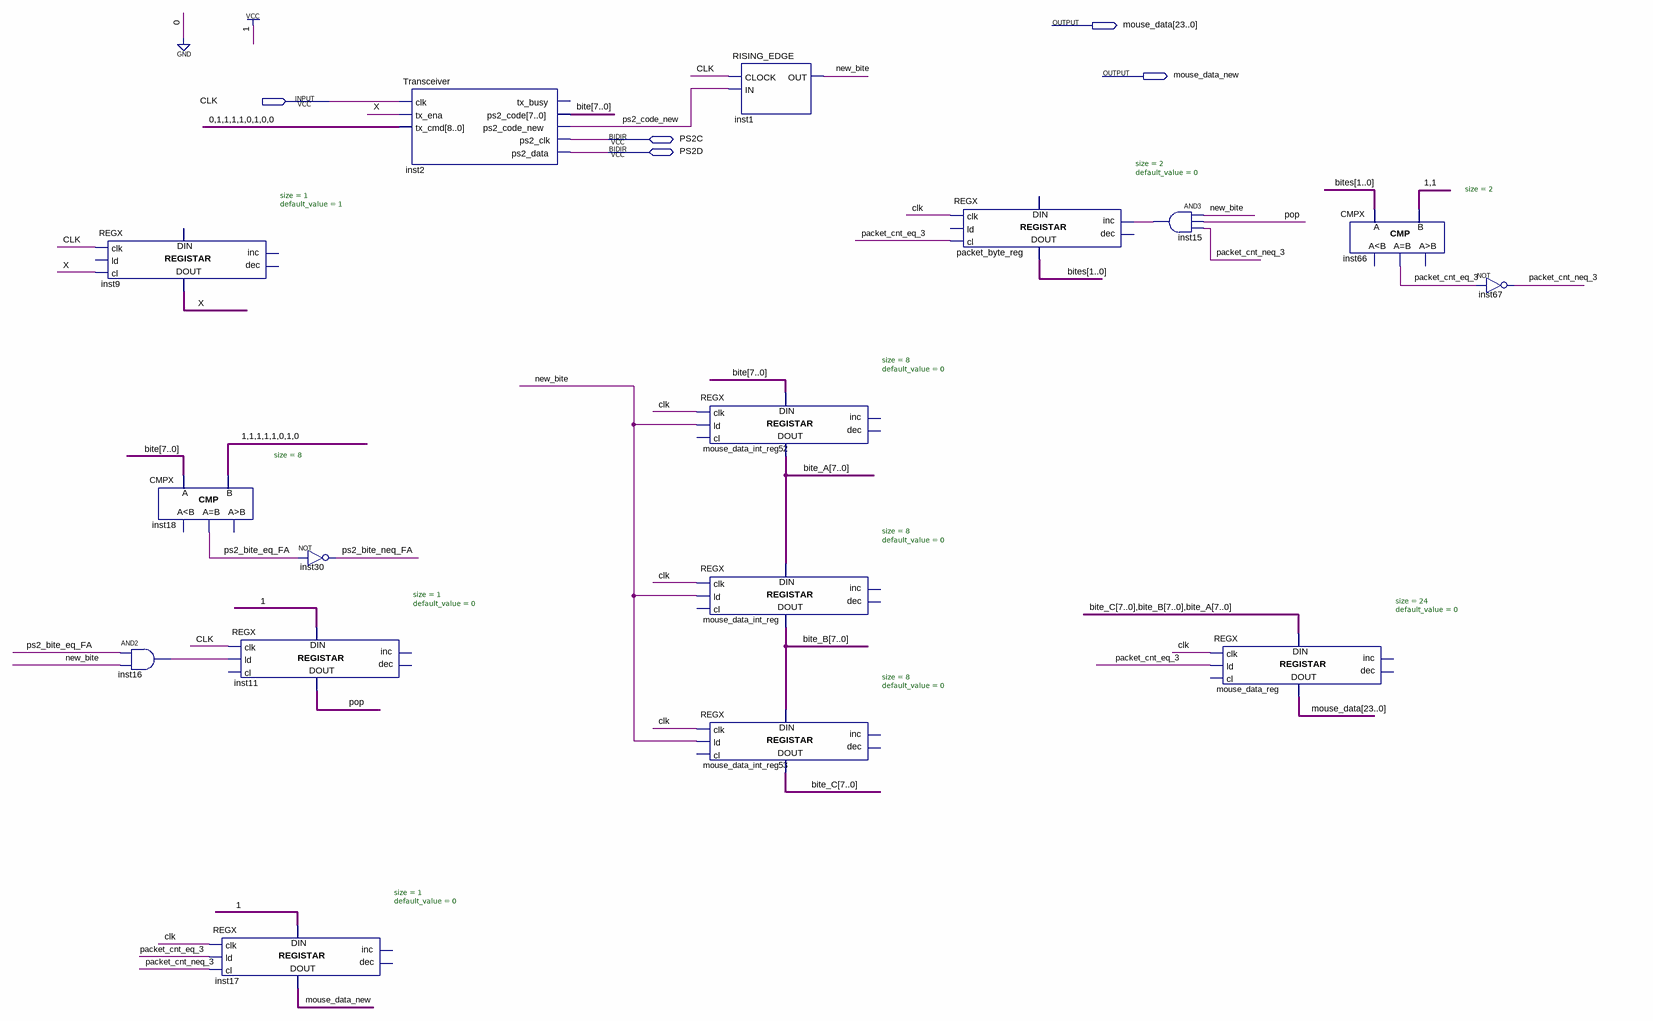
[diagram p0: schematic sheet]
// Quartus schematic MousePS2.bdf as structural Verilog: 16 symbols, 5 pins
module MousePS2 (
  input  CLK,
  inout  PS2C,
  inout  PS2D,
  output [23:0] mouse_data,
  output mouse_data_new
);

  wire inst15_out, inst16_out, new_bite, packet_cnt_eq_3, packet_cnt_neq_3, pop, ps2_bite_eq_FA,
       ps2_bite_neq_FA, ps2_code_new, X;
  wire [1:0] bites;
  wire [7:0] bite, bite_A, bite_B, bite_C;

  REGX #(.size(1), .default_value(1)) inst9 (.clk(CLK), .cl(X), .data_out(X));  // open: ld, inc, dec, data_in
  and inst16 (inst16_out, ps2_bite_eq_FA, new_bite);
  CMPX #(.size(8)) inst18 (.A(bite), .B(8'b11111010), .eq(ps2_bite_eq_FA));  // open: ls, gr
  REGX #(.size(1), .default_value(0)) inst11 (
    .clk(CLK), .ld(inst16_out), .data_in(1'b1), .data_out(pop));  // open: cl, inc, dec
  REGX #(.size(1), .default_value(0)) inst17 (
    .clk(CLK), .ld(packet_cnt_eq_3), .cl(packet_cnt_neq_3), .data_in(1'b1), .data_out(mouse_data_new));  // open: inc, dec
  not inst30 (ps2_bite_neq_FA, ps2_bite_eq_FA);
  Transceiver inst2 (
    .clk(CLK), .tx_ena(X), .tx_cmd(9'b011110100), .ps2_code(bite), .ps2_code_new(ps2_code_new),
    .ps2_clk(PS2C), .ps2_data(PS2D));  // open: tx_busy
  RISING_EDGE inst1 (.CLOCK(CLK), .IN(ps2_code_new), .OUT(new_bite));
  REGX #(.size(8), .default_value(0)) mouse_data_int_reg52 (
    .clk(CLK), .ld(new_bite), .data_in(bite), .data_out(bite_A));  // open: cl, inc, dec
  REGX #(.size(8), .default_value(0)) mouse_data_int_reg (
    .clk(CLK), .ld(new_bite), .data_in(bite_A), .data_out(bite_B));  // open: cl, inc, dec
  REGX #(.size(8), .default_value(0)) mouse_data_int_reg53 (
    .clk(CLK), .ld(new_bite), .data_in(bite_B), .data_out(bite_C));  // open: cl, inc, dec
  REGX #(.size(2), .default_value(0)) packet_byte_reg (
    .clk(CLK), .cl(packet_cnt_eq_3), .inc(inst15_out), .data_out(bites));  // open: ld, dec, data_in
  and inst15 (inst15_out, new_bite, pop, packet_cnt_neq_3);
  REGX #(.size(24), .default_value(0)) mouse_data_reg (
    .clk(CLK), .ld(packet_cnt_eq_3), .data_in({bite_C, bite_B, bite_A}), .data_out(mouse_data));  // open: cl, inc, dec
  CMPX #(.size(2)) inst66 (.A(bites), .B(2'b11), .eq(packet_cnt_eq_3));  // open: ls, gr
  not inst67 (packet_cnt_neq_3, packet_cnt_eq_3);
endmodule
